# EAGLE design XOR (EAGLE 6.5.0)
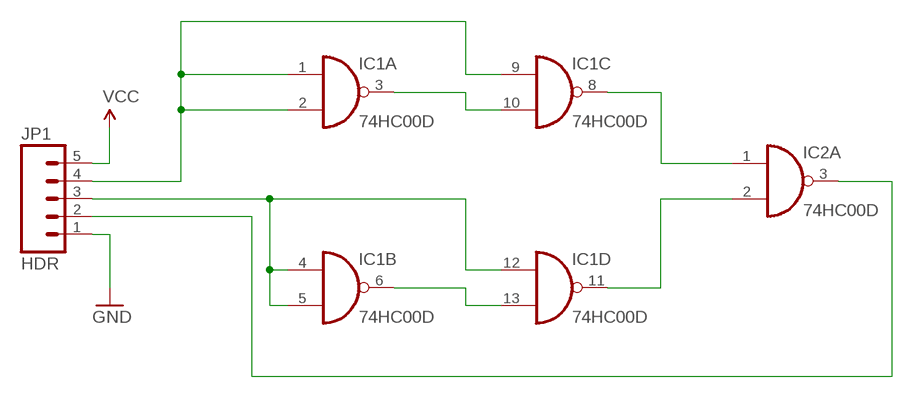
[diagram p0: schematic, sheet 1]

## Parts
IC1  74HC00D  [SO14]
IC2  74HC00D  [SO14]
JP1  HDR  M05LOCK  [1X05_LOCK]

## Nets
GND: JP1.1
N$1: IC1.1(A:I0) IC1.2(A:I1) IC1.9(C:I0) JP1.4
N$2: IC1.3(A:O) IC1.10(C:I1)
N$3: IC1.6(B:O) IC1.13(D:I1)
N$4: IC1.4(B:I0) IC1.5(B:I1) IC1.12(D:I0) JP1.3
N$5: IC1.8(C:O) IC2.1(A:I0)
N$6: IC1.11(D:O) IC2.2(A:I1)
N$7: IC2.3(A:O) JP1.2
VCC: JP1.5
Unconnected: IC2.4(B:I0) IC2.5(B:I1) IC2.6(B:O) IC2.8(C:O) IC2.9(C:I0) IC2.10(C:I1) IC2.11(D:O) IC2.12(D:I0) IC2.13(D:I1)

## Power pins joined to a net without a drawn wire
GND: IC1.7(P:GND) IC2.7(P:GND)
VCC: IC1.14(P:VCC) IC2.14(P:VCC)

## Library data of the parts
IC1 IC2 = 74xx-eu:74*00: Quad 2-input NAND gate
JP1 = SparkFun-Connectors:M05: Header 5 Standard 5-pin 0.1" header. Use with straight break away headers (SKU : PRT-00116), right angle break away headers (PRT-00553), swiss pins (PRT-00743), machine pins (PRT-00117), and female headers (PRT-00115). Molex polarized connector foot print use with SKU : PRT-08230 with associated crimp pins and housings.

## Board
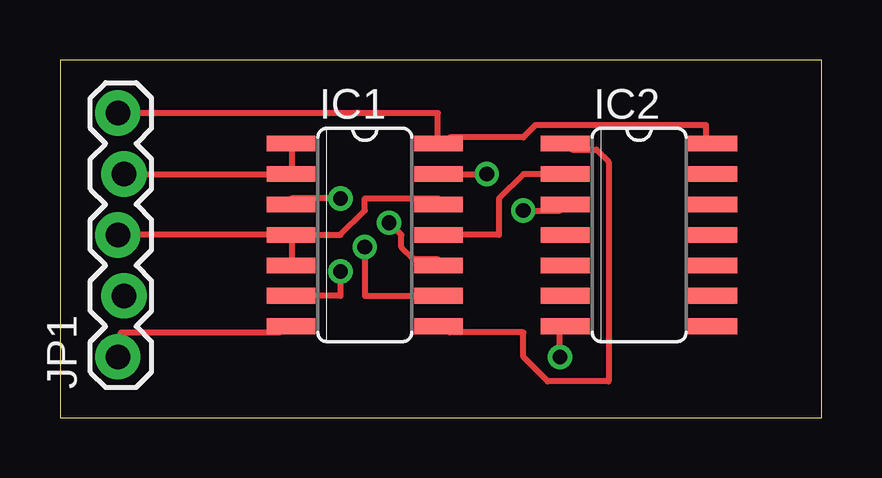
[diagram p1: board, top side]
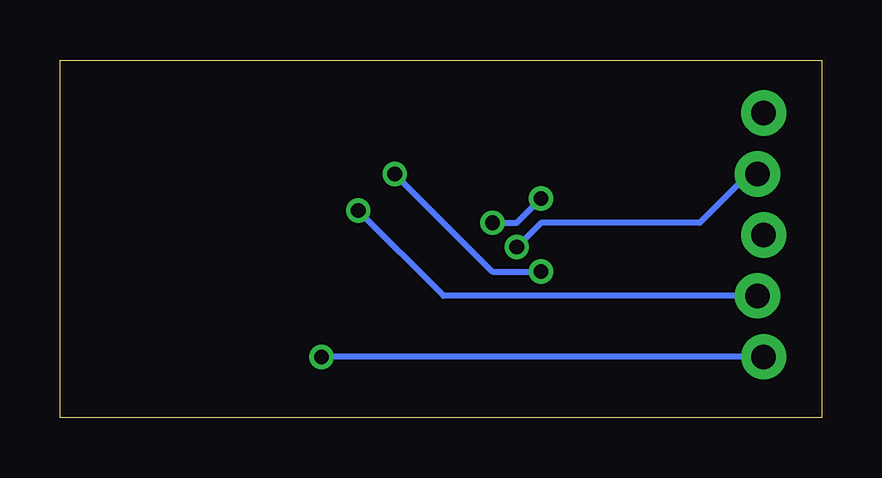
[diagram p2: board, bottom side, seen from below]

Size 31.73 x 14.91 mm. Coordinates in mm from the lower left corner, seen from the top.
Outline: 0,0 31.73,0 31.73,14.91 0,14.91 0,0
Copper layers (1*16): Top 0.035mm / dielectric 1.5mm / Bottom 0.035mm
Design rules "default": minimum track width 10mil, minimum drill 24mil, track to track 8mil, track to pad 8mil, pad to pad 8mil, via to via 8mil, smd to smd 8mil, copper to edge 40mil, drill to drill 8mil, minimum pad ring 10mil, minimum via ring 8mil, stop-mask expansion 4mil, vias tented up to drill 0mil, thermal gap 10mil

### Footprints (pad centres in the part's own frame; a part is rotated, then mirrored left to right if it is on the bottom)
SO14 = smd 0.66 x 2.032: 1 -3.81,-3.073; 2 -2.54,-3.073; 3 -1.27,-3.073; 4 0,-3.073; 5 1.27,-3.073; 6 2.54,-3.073; 7 3.81,-3.073; 8 3.81,3.073; 9 2.54,3.073; 10 1.27,3.073; 11 0,3.073; 12 -1.27,3.073; 13 -2.54,3.073; 14 -3.81,3.073
1X05_LOCK = drill 1.016 pad 1.88: 1 0,0.127; 2 2.54,-0.127; 3 5.08,0.127; 4 7.62,-0.127; 5 10.16,0.127

### Placement (x,y rotation side)
IC1  12.7,7.62 270 top
IC2  24.13,7.62 270 top
JP1  2.54,2.54 90 top

### Tracks (layer width: path | path; a pad name or v marks a point on that pad's centre or on a via)
GND  (via drill 0.61)
  Top 0.254: IC1.7 9.14,3.56 2.54,3.56 2.54,2.54 JP1.1 | v20.83,2.54 20.83,3.56 IC2.7
  Bottom 0.254: JP1.1 v20.83,2.54
N$1  (via drill 0.61)
  Top 0.254: IC1.1 9.65,11.18 9.65,10.16 IC1.2 JP1.4 | IC1.9 12.7,5.08 v12.7,7.11
  Bottom 0.254: v12.7,7.11 11.68,8.13 5.08,8.13 3.05,10.16 JP1.4
N$2  (via drill 0.61)
  Top 0.254: v11.68,9.14 9.65,9.14 IC1.3 | v13.72,8.13 14.22,7.62 14.22,7.11 14.73,6.6 15.75,6.6 IC1.10
  Bottom 0.254: v11.68,9.14 12.7,8.13 v13.72,8.13
N$3  (via drill 0.61)
  Top 0.254: IC1.6 11.68,5.08 v11.68,6.1 | IC1.13 v17.78,10.16
  Bottom 0.254: v11.68,6.1 13.72,6.1 v17.78,10.16
N$4
  Top 0.254: 9.65,7.62 9.65,6.6 IC1.5 | 9.65,7.62 11.68,7.62 12.7,8.64 12.7,9.14 15.75,9.14 IC1.12 | 9.65,7.62 IC1.4 JP1.3
N$5
  Top 0.254: IC1.8 16.26,3.56 19.3,3.56 19.3,2.54 20.32,1.52 22.86,1.52 22.86,10.67 22.35,11.18 21.34,11.18 IC2.1
N$6
  Top 0.254: IC1.11 18.29,7.62 18.29,9.14 19.3,10.16 IC2.2
N$7  (via drill 0.61)
  Top 0.254: v19.3,8.64 20.83,8.64 IC2.3
  Bottom 0.254: v19.3,8.64 15.75,5.08 JP1.2
VCC
  Top 0.254: IC2.14 26.92,11.68 26.92,12.19 19.81,12.19 19.3,11.68 16.26,11.68 IC1.14 15.75,11.68 15.75,12.7 JP1.5